# Altium schematic sheet SOC.SchDoc
size 594 x 419 mm
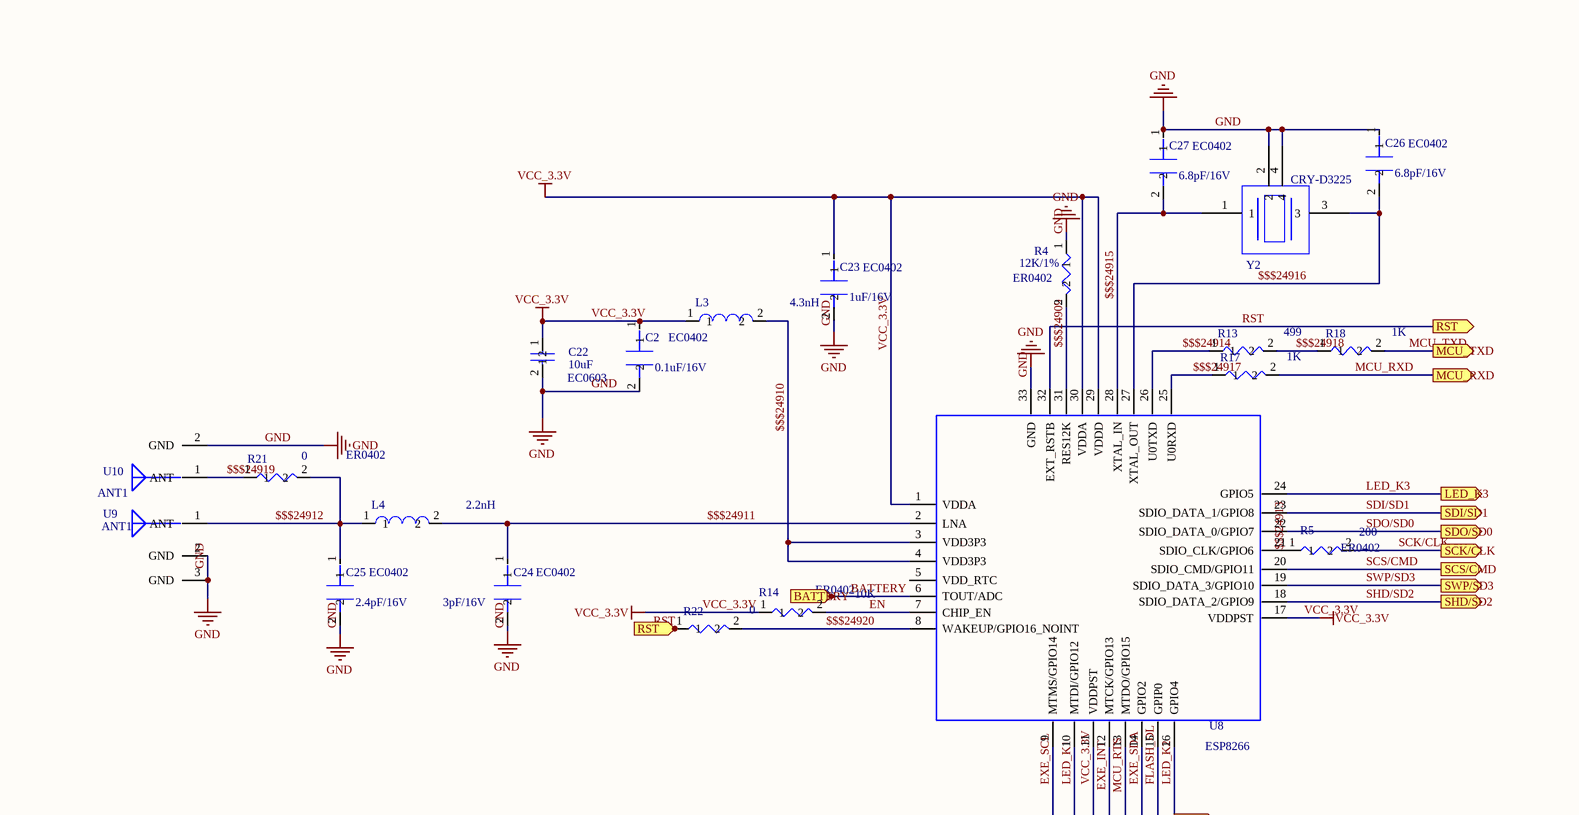
[diagram p0: SOC.SchDoc, top left]
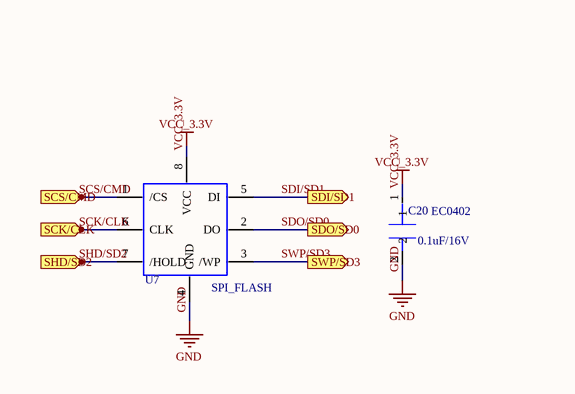
[diagram p1: SOC.SchDoc, top right]
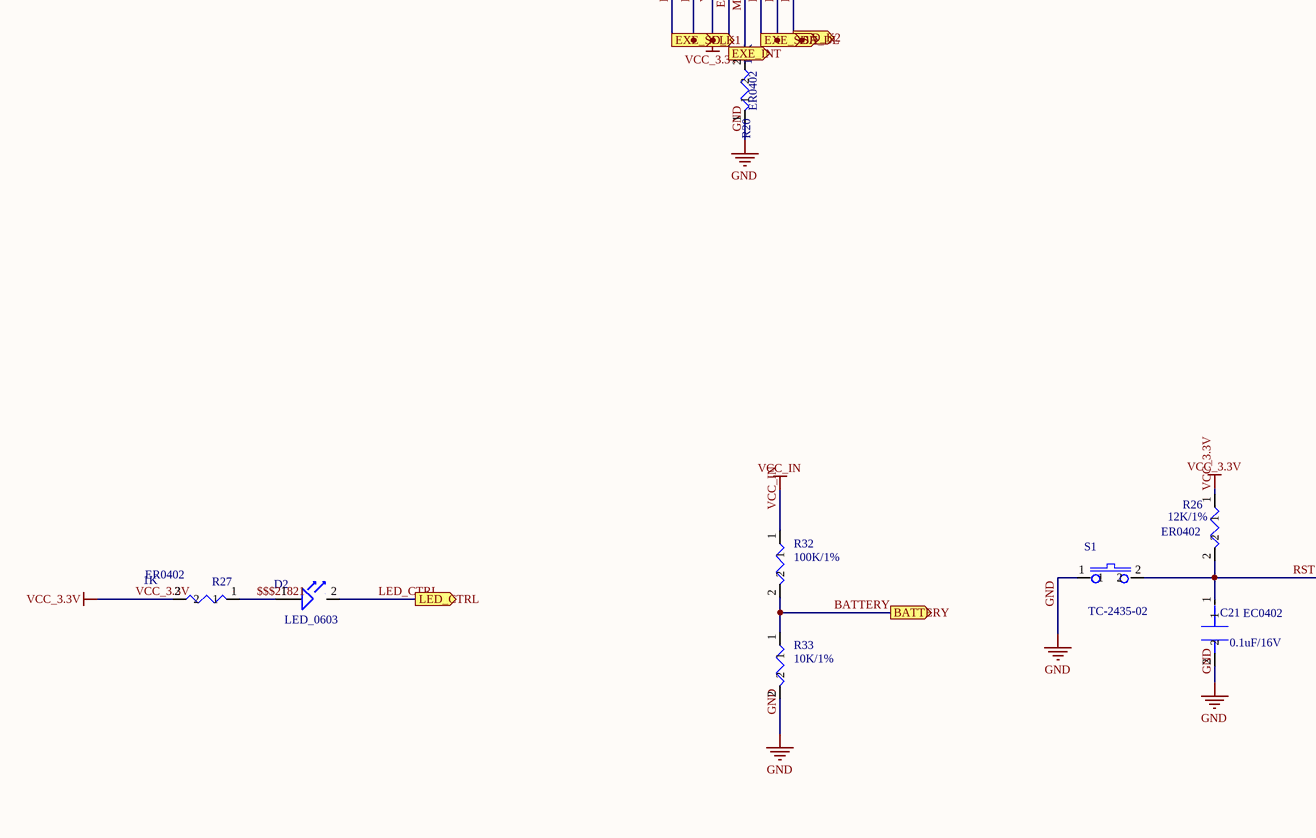
[diagram p2: SOC.SchDoc, bottom left]
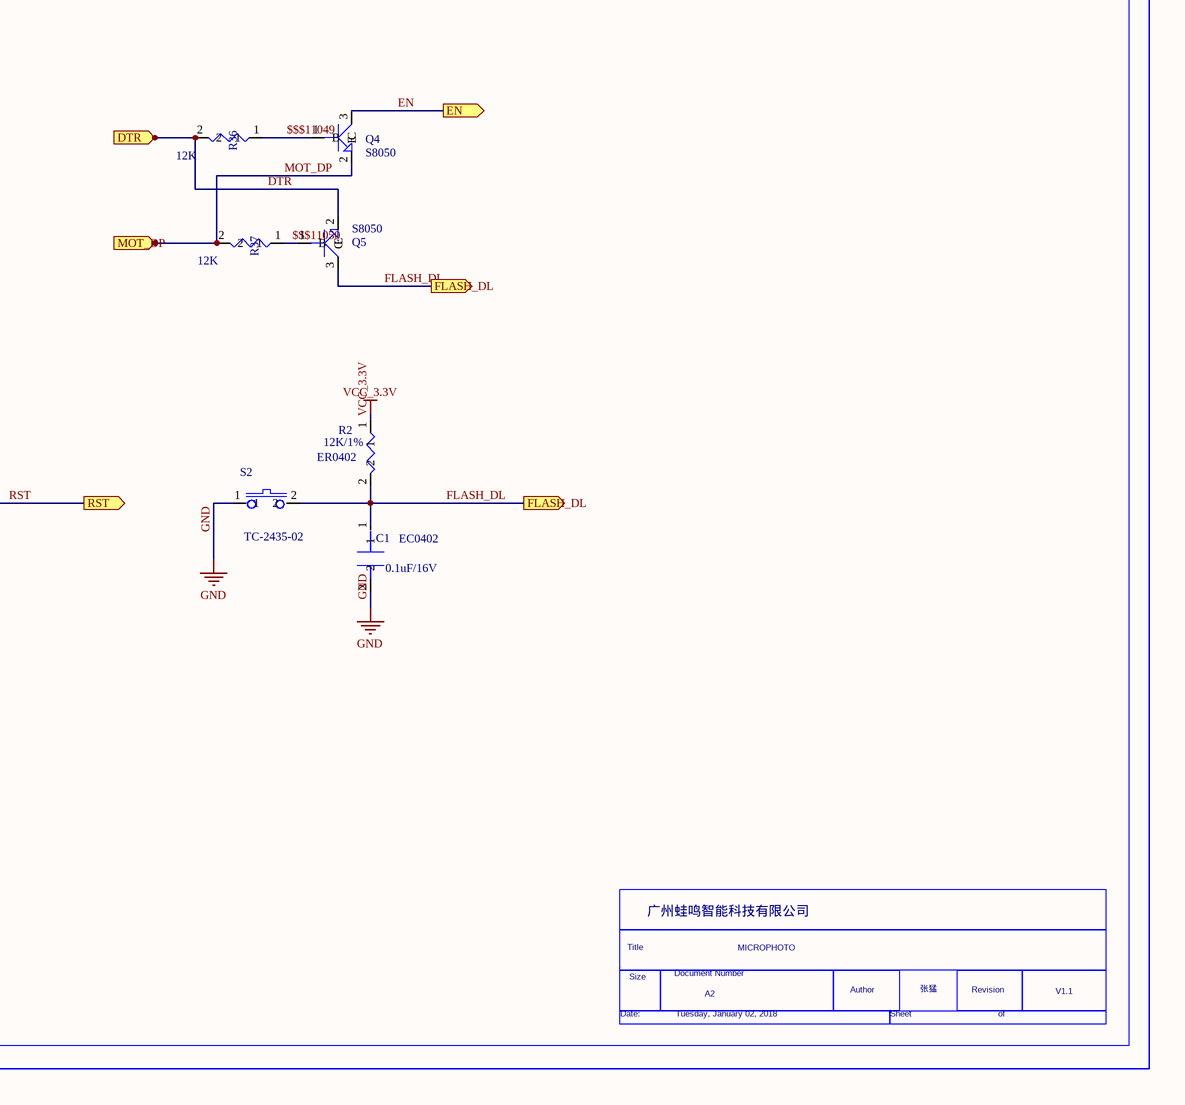
[diagram p3: SOC.SchDoc, bottom right]

## Parts
C1  EC0402  value 0.1uF/16V
C2  EC0402  value 0.1uF/16V
C20  EC0402  value 0.1uF/16V
C21  EC0402  value 0.1uF/16V
C22  EC0603  value 10uF
C23  EC0402  value 1uF/16V
C24  EC0402  value 3pF/16V
C25  EC0402  value 2.4pF/16V
C26  EC0402  value 6.8pF/16V
C27  EC0402  value 6.8pF/16V
D2  LED_0603
L3  value 4.3nH  (hidden comment: INDUCTOR_0402)
L4  value 2.2nH  (hidden comment: INDUCTOR_0402)
Q4  S8050
Q5  S8050
R2  ER0402  value 12K/1%
R4  ER0402  value 12K/1%
R5  ER0402  value 200
R13  value 499  (hidden comment: ER0402)
R14  ER0402  value 10K
R17  value 1K  (hidden comment: ER0402)
R18  value 1K  (hidden comment: ER0402)
R20  ER0402  value 10K
R21  ER0402  value 0
R22  value 0  (hidden comment: ER0402)
R26  ER0402  value 12K/1%
R27  ER0402  value 1K
R32  value 100K/1%  (hidden comment: ER0402)
R33  value 10K/1%  (hidden comment: ER0402)
R36  value 12K  (hidden comment: ER0402)
R37  value 12K  (hidden comment: ER0402)
S1  value TC-2435-02  (hidden comment: SW3X6)
S2  value TC-2435-02  (hidden comment: SW3X6)
U7  SPI_FLASH
U8  ESP8266
U9  value ANT1  (hidden comment: ANT_IPX)
U10  value ANT1  (hidden comment: ANT_PCB)
Y2  CRY-D3225

## Ports
BATTERY, DTR, EN, EXE_INT, EXE_SCL, EXE_SDA, FLASH_DL, LED_CTRL, LED_K1, LED_K2, LED_K3, MCU_RXD, MCU_TXD, MOT_DP, RST, SCK/CLK, SCS/CMD, SDI/SD1, SDO/SD0, SHD/SD2, SWP/SD3

## Nets
GND: C1.2 C2.2 C20.2 C21.2 C22.2 C23.2 C24.2 C25.2 C26.1 C27.1 R4.1 R20.1 R33.2 S1.1 S2.1 U7.4(GND) U8.33(GND) U9.2(GND) U9.3(GND) U10.2(GND) Y2.2 Y2.4
VCC_3.3V: C2.1 C20.1 C22.1 C23.1 L3.1 R2.1 R14.1 R26.1 R27.2 U7.8(VCC) U8.1(VDDA) U8.11(VDDPST) U8.17(VDDPST) U8.29(VDDD) U8.30(VDDA)
VCC_IN: R32.1
$$$11049: Q4.1(B) R36.1
$$$11050: Q5.1(B) R37.1
$$$21821: D2.1 R27.1
$$$24909: R4.2 U8.31(RES12K)
$$$24910: L3.2 U8.3(VDD3P3) U8.4(VDD3P3)
$$$24911: C24.1 L4.2 U8.2(LNA)
$$$24912: C25.1 L4.1 R21.2 U9.1(ANT)
$$$24913: R5.1 U8.21(SDIO_CLK/GPIO6)
$$$24914: R13.1 U8.26(U0TXD)
$$$24915: C27.2 U8.28(XTAL_IN) Y2.1
$$$24916: C26.2 U8.27(XTAL_OUT) Y2.3
$$$24917: R17.1 U8.25(U0RXD)
$$$24918: R13.2 R18.1
$$$24919: R21.1 U10.1(ANT)
$$$24920: R22.2 U8.8(WAKEUP/GPIO16_NOINT)
BATTERY: R32.2 R33.1 U8.6(TOUT/ADC) ; port BATTERY
DTR: Q5.2(E) R36.2 ; port DTR
EN: Q4.3(C) R14.2 U8.7(CHIP_EN) ; port EN
EXE_INT: U8.12(MTCK/GPIO13) ; port EXE_INT
EXE_SCL: U8.9(MTMS/GPIO14) ; port EXE_SCL
EXE_SDA: U8.14(GPIO2) ; port EXE_SDA
FLASH_DL: C1.1 Q5.3(C) R2.2 S2.2 U8.15(GPIP0) ; port FLASH_DL
LED_CTRL: D2.2 ; port LED_CTRL
LED_K1: U8.10(MTDI/GPIO12) ; port LED_K1
LED_K2: U8.16(GPIO4) ; port LED_K2
LED_K3: U8.24(GPIO5) ; port LED_K3
MCU_RTS: R20.2 U8.13(MTDO/GPIO15)
MCU_RXD: R17.2 ; port MCU_RXD
MCU_TXD: R18.2 ; port MCU_TXD
MOT_DP: Q4.2(E) R37.2 ; port MOT_DP
RST: C21.1 R22.1 R26.2 S1.2 U8.32(EXT_RSTB) ; port RST
SCK/CLK: R5.2 U7.6(CLK) ; port SCK/CLK
SCS/CMD: U7.1(/CS) U8.20(SDIO_CMD/GPIO11) ; port SCS/CMD
SDI/SD1: U7.5(DI) U8.23(SDIO_DATA_1/GPIO8) ; port SDI/SD1
SDO/SD0: U7.2(DO) U8.22(SDIO_DATA_0/GPIO7) ; port SDO/SD0
SHD/SD2: U7.7(/HOLD) U8.18(SDIO_DATA_2/GPIO9) ; port SHD/SD2
SWP/SD3: U7.3(/WP) U8.19(SDIO_DATA_3/GPIO10) ; port SWP/SD3

Not connected (* = marked no-connect by the designer): U8 5(VDD_RTC)

## Notes on the sheet
- 广州蛙鸣智能科技有限公司
- Title
- Size
- Document Number
- MICROPHOTO
- Date:
- Tuesday, January 02, 2018
- A2
- Author
- Sheet
- 张猛
- Revision
- of
- V1.1

## Library data of the parts
C1 C21 C23-C27 = EC0402: Source_Path: E:\PROJECT\BGA441\MAINCHIP_DDR2_DDR3_V1.0.DSN; PAGE: 2
C2 = EC0402: Source_Path: E:\PROJECT\BGA441\MAINCHIP_DDR2_DDR3_V1.0.DSN; PAGE: 2; PCB DECAL: C0402
C20 = EC0402: Source_Path: E:\PROJECT\BGA441\MAINCHIP_DDR2_DDR3_V1.0.DSN; PAGE: 2; PCB DECAL: EC0603
C22 = EC0603: PAGE: 1; Source_Path: E:\LIB\LIBRARY1.OLB; PCB DECAL: C0603
L3 L4 = INDUCTOR_0402: Source_Path: E:\COMPANY\ORCAD\RK2908\4.2V\RK2918_REF_CD_V1.0_20110225.DSN; ROOM: LCD-AVDD; PCB DECAL: ER0402
Q4 Q5 = S8050: Source_Path: D:\DROPBOX\ORCAD LIBRARY\ROCK-CHIPS.OLB; PCB DECAL: SOT23; Value: S8050
R32 R33 R36 R37 = ER0402: Source_Path: D:\ORCAD LIB\LIB_E1A.OLB; PCB DECAL: ER0603
S1 S2 = SW3X6: 按键; Source_Path: D:\WORK\RK29XX\RK29XX_SDK\RK29XX_SDK_V1.0\RK29XX_SDK_MB.DSN; PCB DECAL: SW3X6
U7 = SPI_FLASH: PCB DECAL: SO8-W
U8 = ESP8266: PCB DECAL: QFN32
U9 = ANT_IPX: ANT; Source_Path: C:\USERS\ZM\DESKTOP\R17-V1.0\RK3128-R17-V1.0-20170221.DSN; PCB DECAL: ECT8180001581
U10 = ANT_PCB: ANT; Source_Path: C:\USERS\ZM\DESKTOP\R17-V1.0\RK3128-R17-V1.0-20170221.DSN; PCB DECAL: ANT_PCB
Y2 = CRY-D3225: Value: NX3225SA-26.000MSTD-CSQ-1; Source_Path: C:\ALTIUM\ORCADLIB.OLB; PCB DECAL: CRY-D3225
D2 = LED_0603: PCB DECAL: LED_0603
R2 R4 R5 R13 R14 R17 R18 R20-R22 R26 R27 = ER0402: PCB DECAL: ER0402